# EasyEDA Pro project BackupProjects_martinnohr_personal_0_20240117.eprj

# Schematic Magic Image Wand PCB with PS

## Sheets
1 TTGO_CIRCUIT_PCB_PS
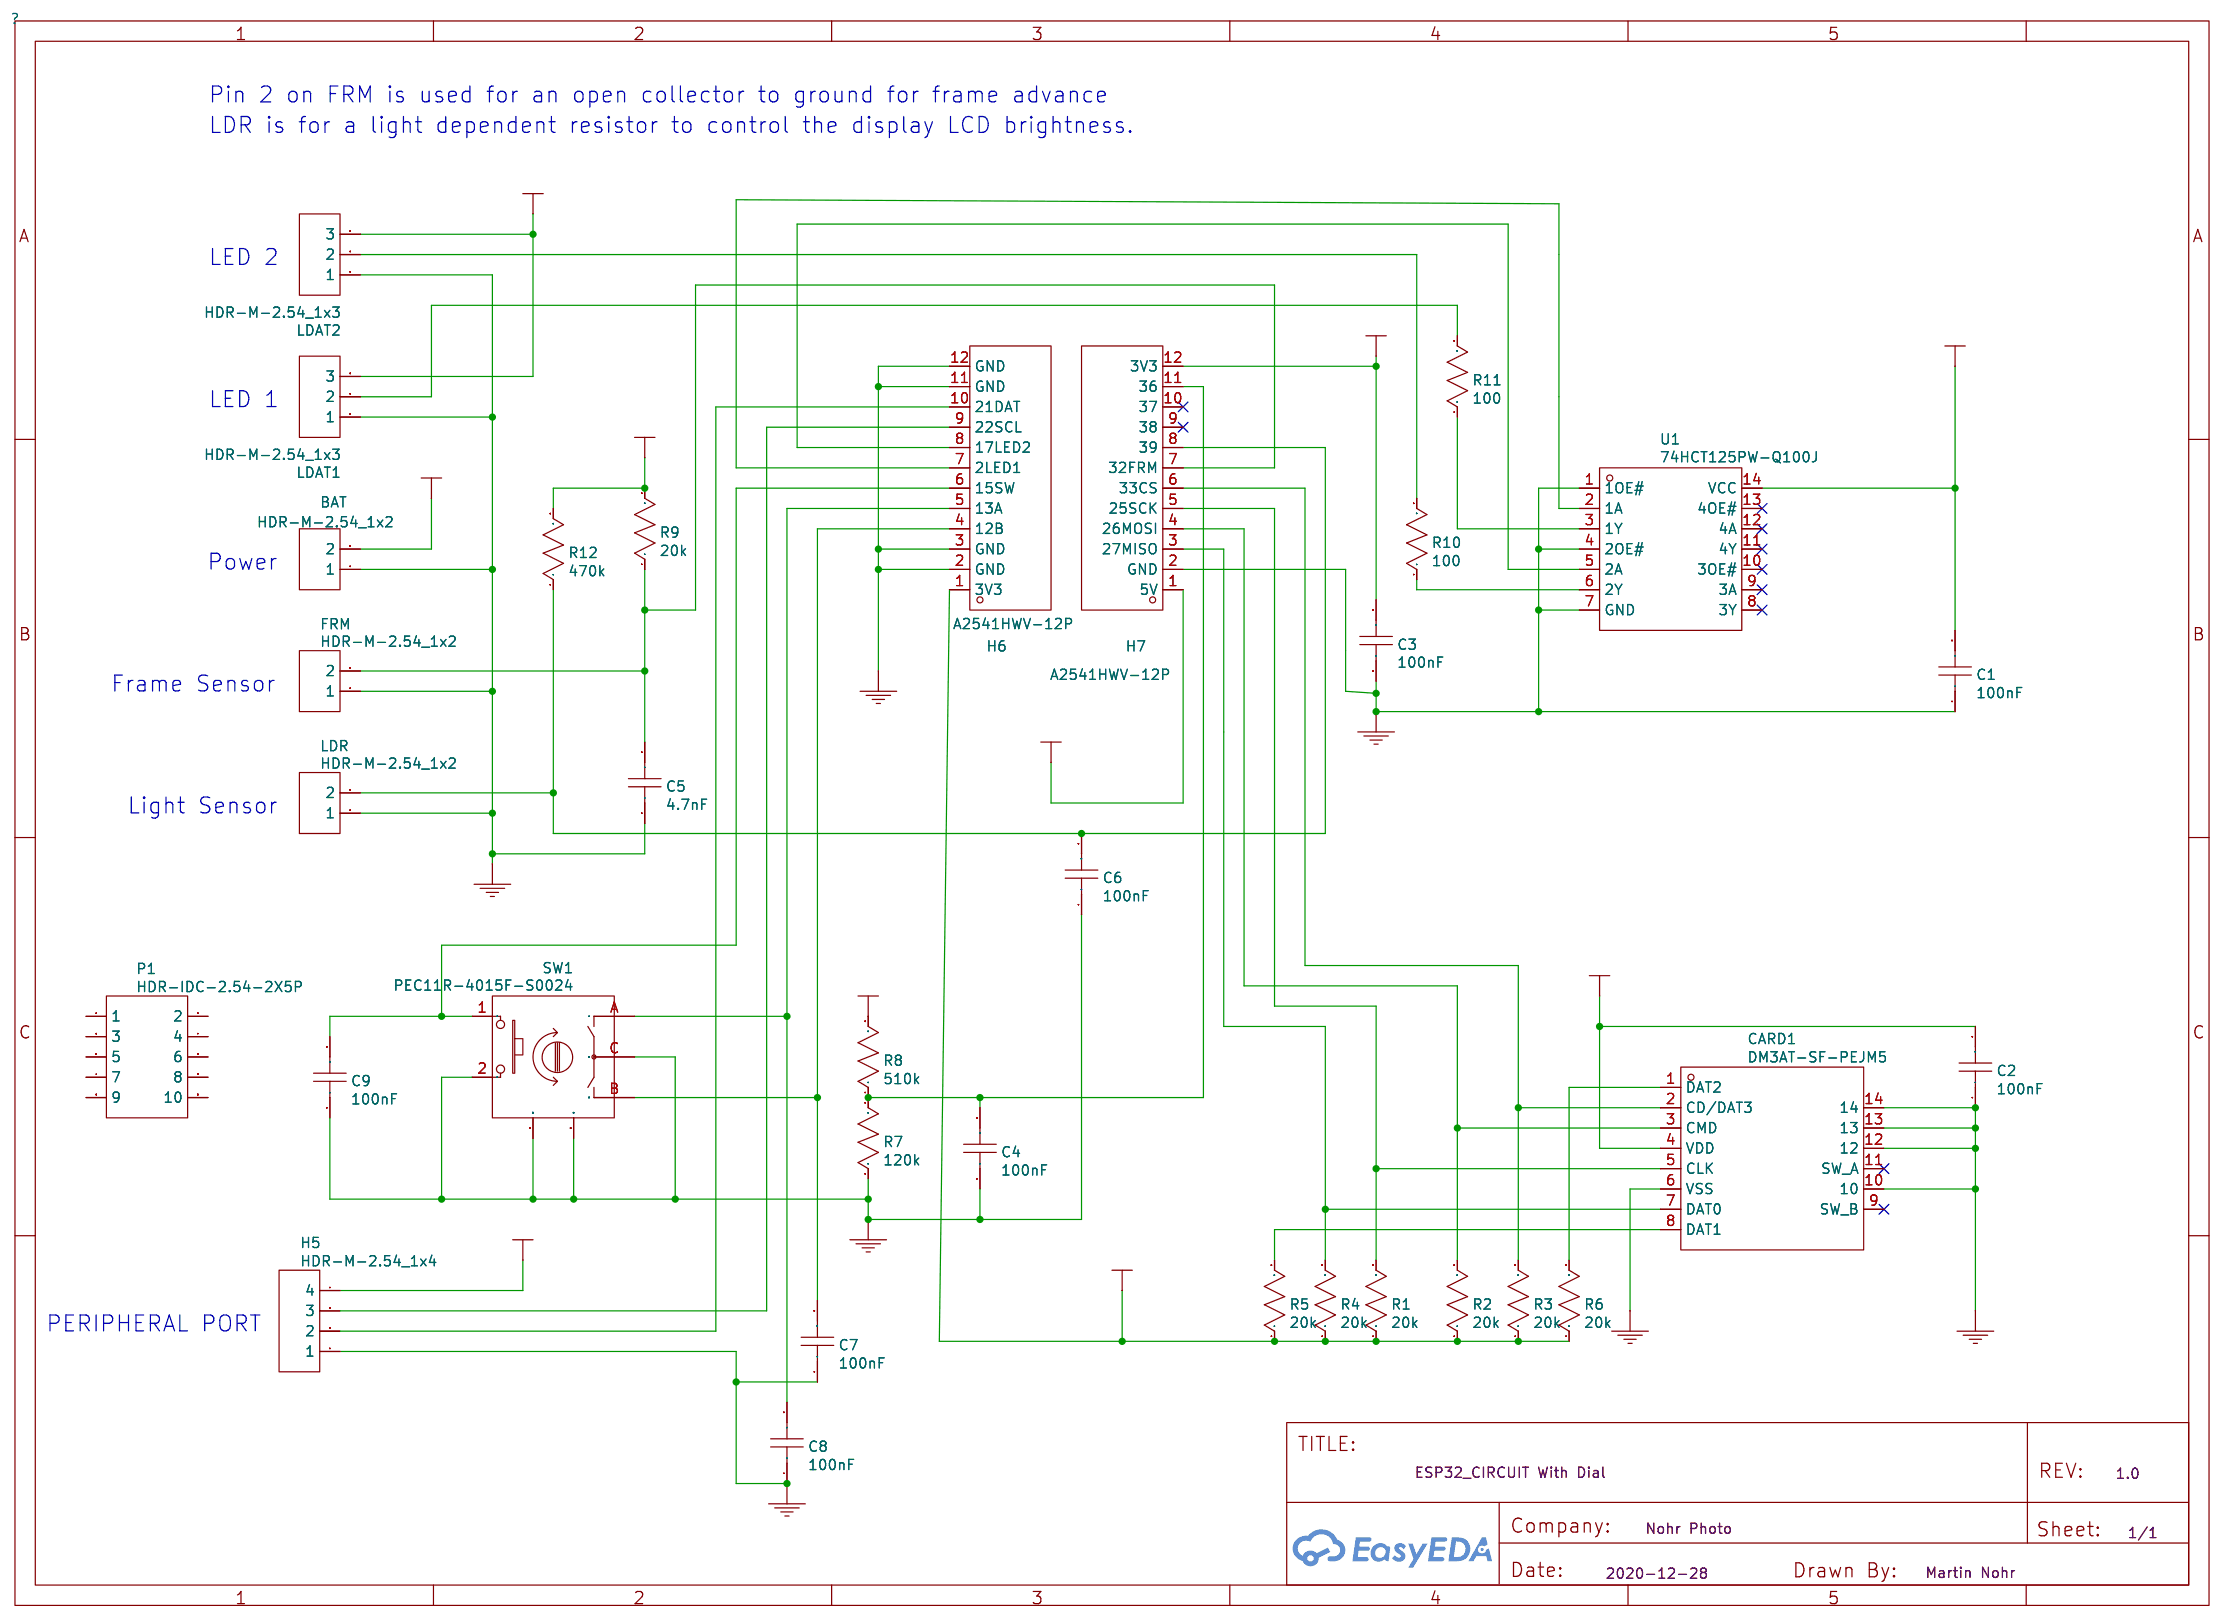
[diagram p0: TTGO_CIRCUIT_PCB_PS]
2 TTGO External Components
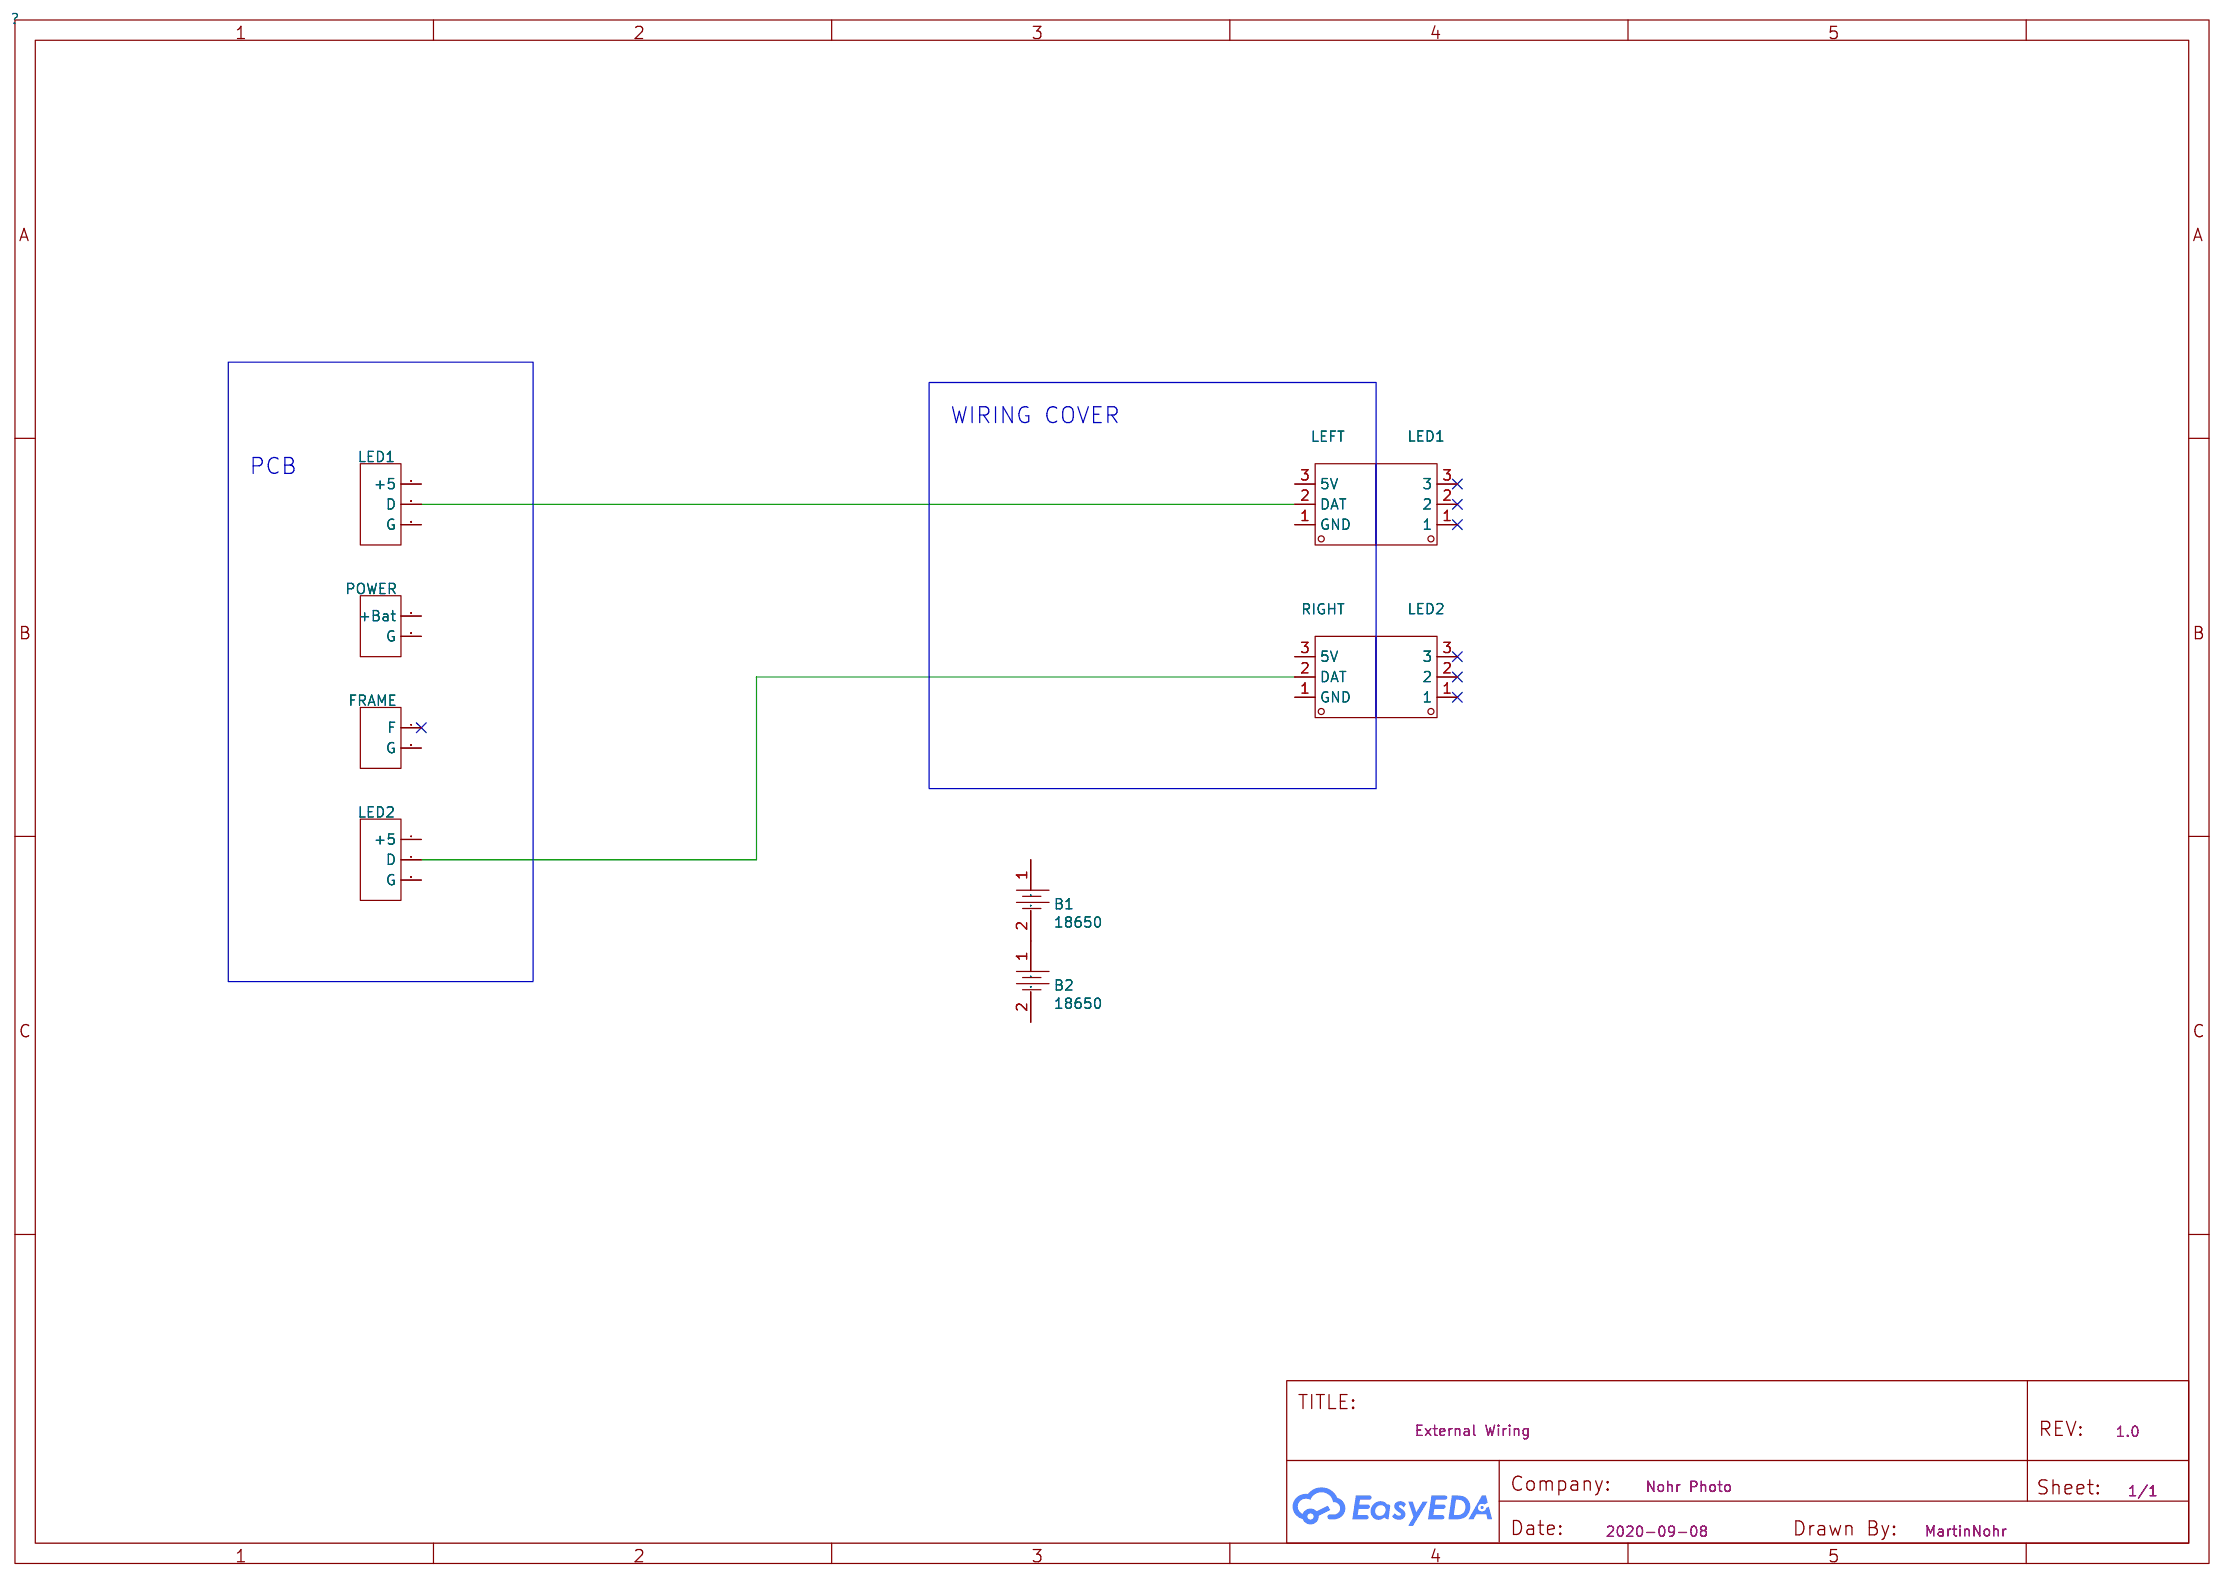
[diagram p1: TTGO External Components]
3 Power Supply
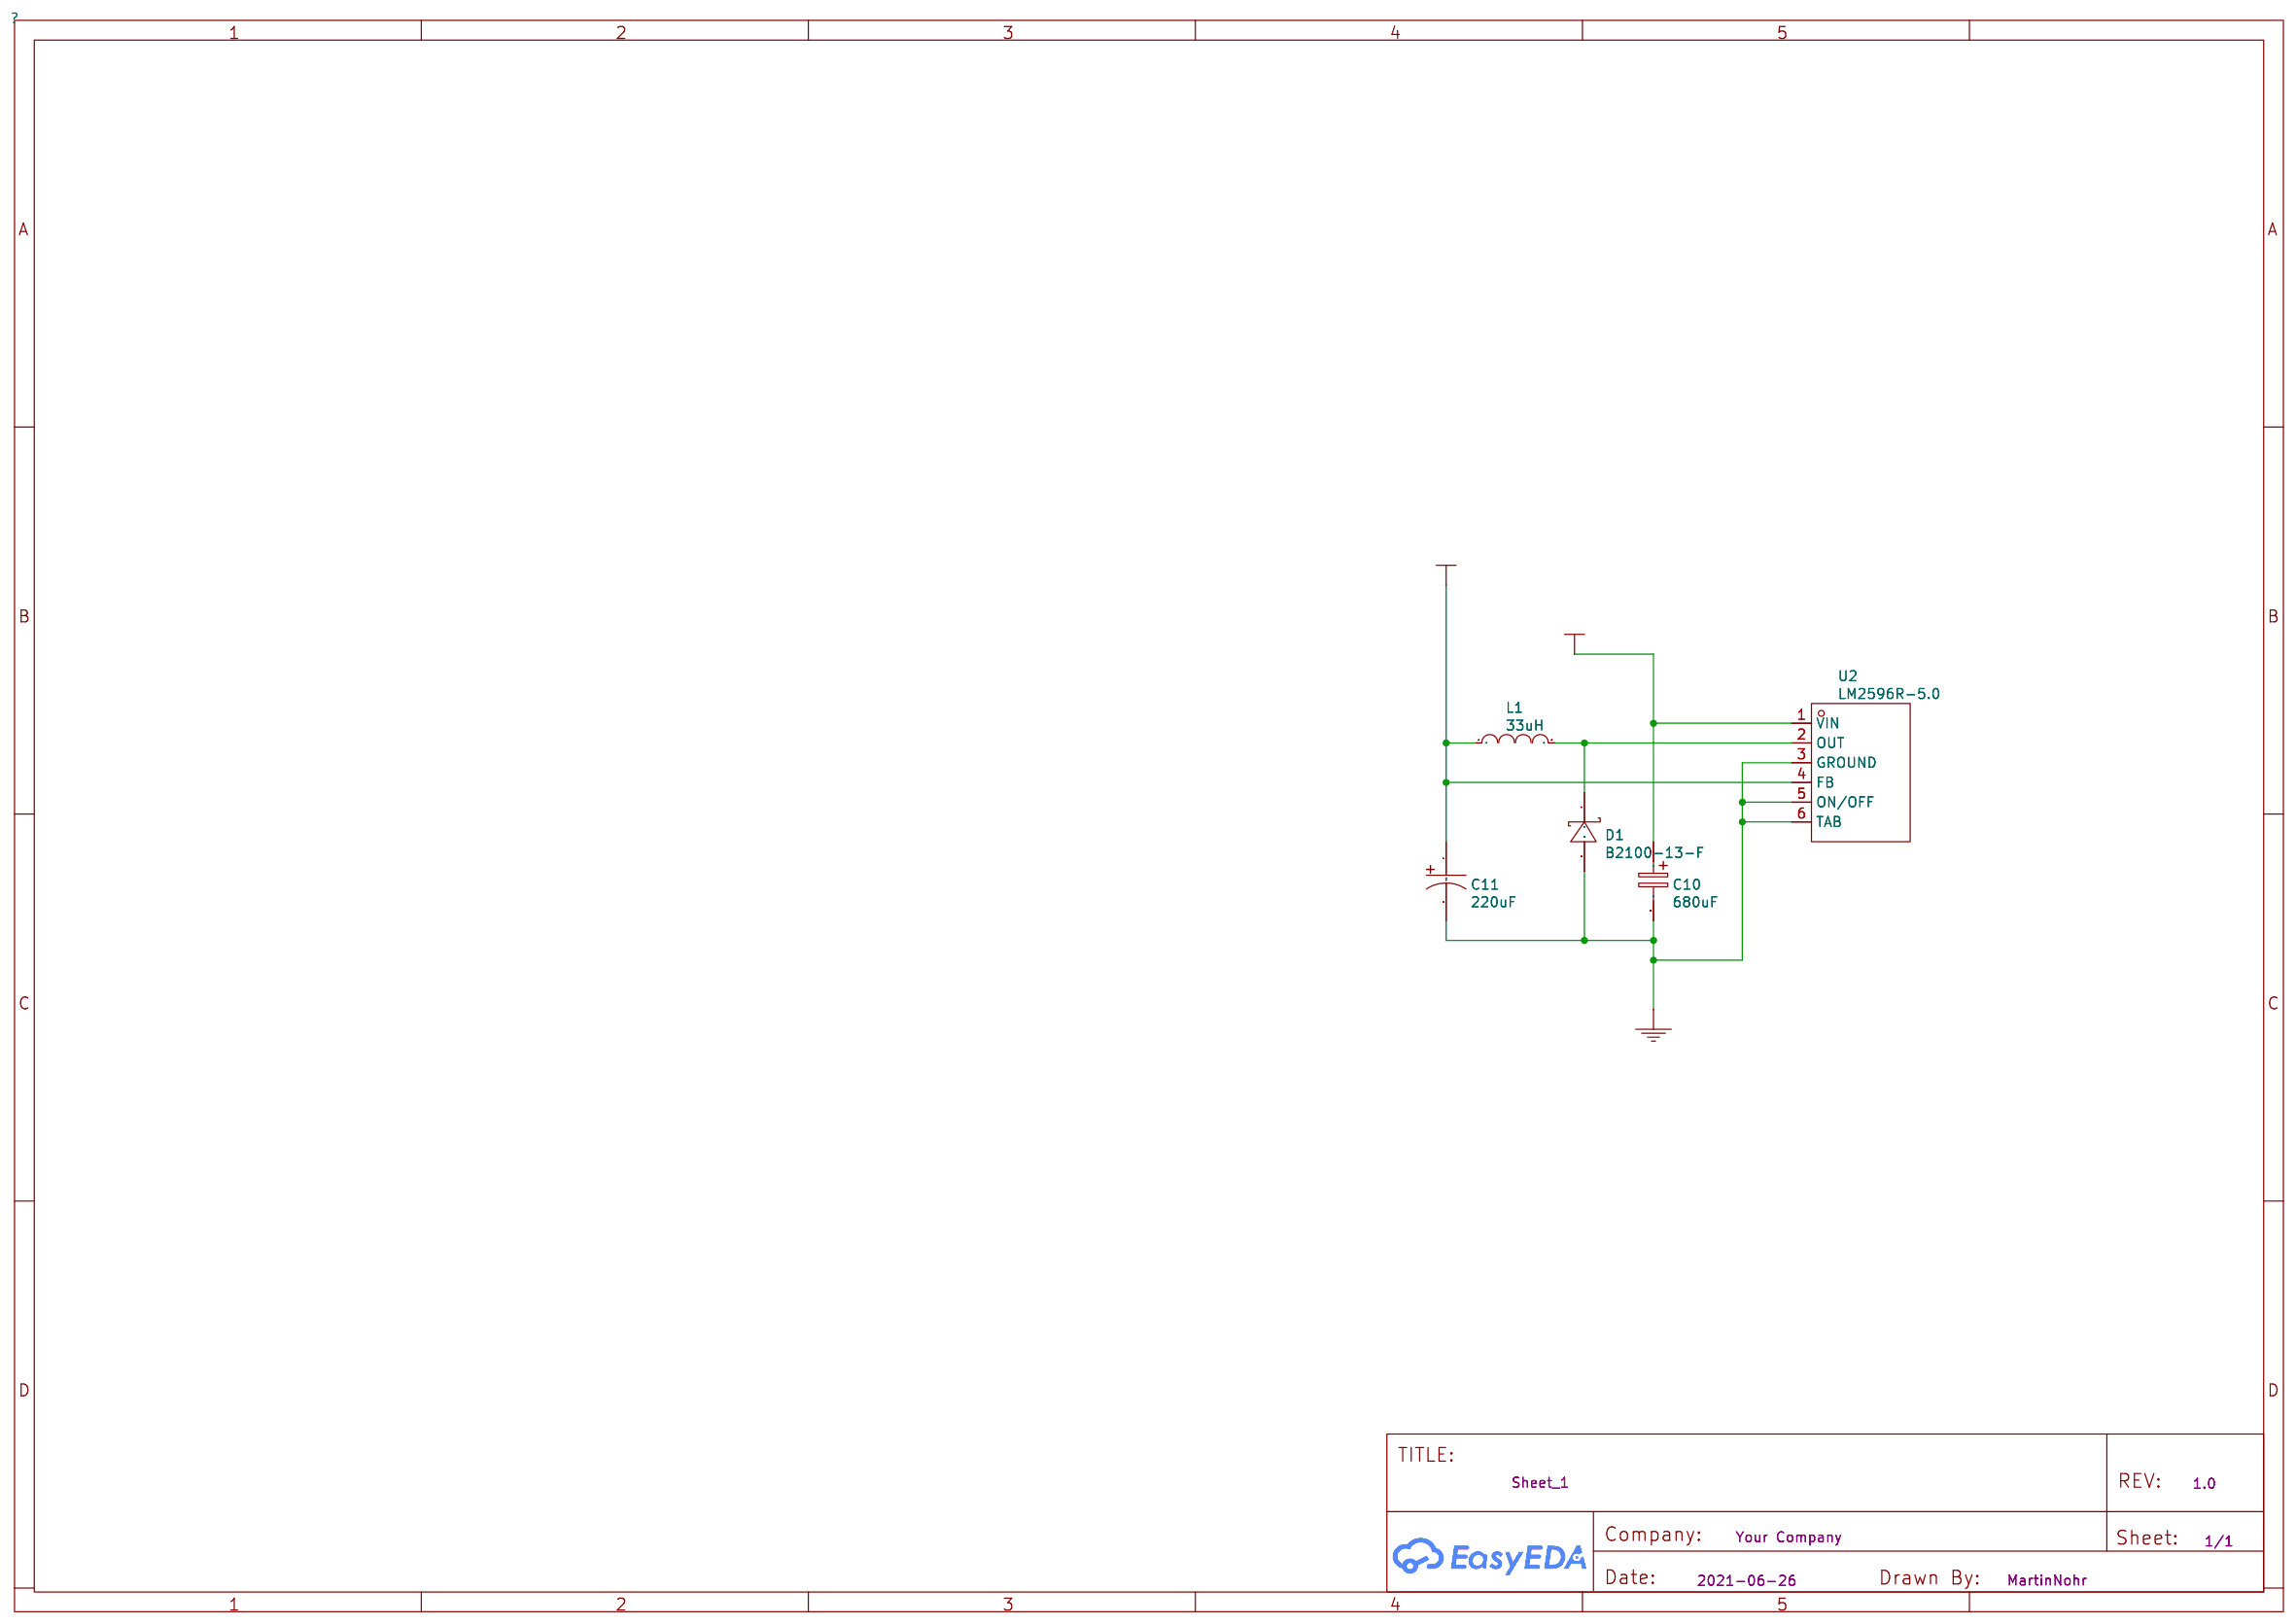
[diagram p2: Power Supply]

## Parts
sheet Power Supply
C10  680uF  [CAP-SMD_L7.3-W4.3-R-RD]
C11  220uF  [CAP-SMD_L7.3-W4.3]
D1  B2100-13-F  [SMB_L4.6-W3.6-LS5.3-RD]
L1  33uH  [IND-SMD_L12.5-W12.5_SWRH1207B]
U2  LM2596R-5.0  [TO-263-5_L10.2-W8.6-P1.70-LS14.4-TL]
sheet TTGO External Components
B1  18650  (no BOM)
B2  18650  (no BOM)
H8  LED1  (no BOM)
H9  LED2  (no BOM)
H10  POWER  (no BOM)
H11  FRAME  (no BOM)
LED1  68000-103HLF  (no BOM)
LED2  68000-103HLF  (no BOM)
LEFT  68000-103HLF  (no BOM)
RIGHT  68000-103HLF  (no BOM)
sheet TTGO_CIRCUIT_PCB_PS
BAT  HDR-M-2.54_1x2  [HDR-M-2.54_1X2]  (no BOM)
C1  100nF  [C0603]
C2  100nF  [C0603]
C3  100nF  [C0603]
C4  100nF  [C0603]
C5  4.7nF  [C0603]
C6  100nF  [C0603]
C7  100nF  [C0603]
C8  100nF  [C0603]
C9  100nF  [C0603]
CARD1  DM3AT-SF-PEJM5  [SD-SMD_DM3AT-SF-PEJM5]
FRM  HDR-M-2.54_1x2  [HDR-M-2.54_1X2]  (no BOM)
H5  HDR-M-2.54_1x4  [HDR-M-2.54_1X4]  (no BOM)
H6  A2541HWV-12P  [HDR-TH_12P-P2.54-V_A2541HWV-12P]
H7  A2541HWV-12P  [HDR-TH_12P-P2.54-V_A2541HWV-12P]
LDAT1  HDR-M-2.54_1x3  [HDR-M-2.54_1X3]  (no BOM)
LDAT2  HDR-M-2.54_1x3  [HDR-M-2.54_1X3]  (no BOM)
LDR  HDR-M-2.54_1x2  [HDR-M-2.54_1X2]  (no BOM)
P1  HDR-IDC-2.54-2X5P
R1  20k  [R0603]
R2  20k  [R0603]
R3  20k  [R0603]
R4  20k  [R0603]
R5  20k  [R0603]
R6  20k  [R0603]
R7  120k  [R0603]
R8  510k  [R0603]
R9  20k  [R0603]
R10  100  [R0603]
R11  100  [R0603]
R12  470k  [R0603]
SW1  PEC11R-4015F-S0024  [SW-TH_PEC11R-4XXXF-SXXXX]
U1  74HCT125PW-Q100J  [TSSOP-14_L5.0-W4.4-P0.65-LS6.4-BL]

## Library data of the parts
C10 = 680uF: link: https://item.szlcsc.com/91116.html; 3DModel: CASE-E_L7.3-W4.3-H4.1; Supplier: LCSC; Supplier Part: C542619; Manufacturer: PANASONIC; Manufacturer Part: ETPF680M5H
C11 = 220uF: link: https://item.szlcsc.com/292603.html; 3DModel: CASE-E_L7.3-W4.3-H4.1; Supplier: LCSC; Supplier Part: C215882; Manufacturer: Vishay Intertech; Manufacturer Part: 293D227X9016E2TE3; JLCPCB Part Class: Extended Part
D1 = B2100-13-F: link: https://item.szlcsc.com/288502.html; Supplier: LCSC; Manufacturer: DIODES; Supplier Part: C110479; JLCPCB Part Class: Extended Part
L1 = 33uH: link: https://item.szlcsc.com/61711.html; 3DModel: IND-SMD_L12.5-W12.5-H8.0; Supplier: LCSC; Manufacturer: Sunlord; Manufacturer Part: SWRH1207B-330MT; Supplier Part: C127811; JLCPCB Part Class: Extended Part
U2 = LM2596R-5.0: link: https://item.szlcsc.com/139878.html; 3DModel: TO-263-5-5P_L10.2-W8.7-H4.5-LS14.4-P1.70; Supplier: LCSC; Manufacturer: HTC; Supplier Part: C77782; JLCPCB Part Class: Extended Part
B1 B2 = CR1220-2: Supplier: LCSC; Manufacturer: Q&J; image: //image.lceda.cn/szlcsc/C70381.jpg; Supplier Part: C70381
H8 = LED1: Supplier Part: C146690; Supplier: LCSC
H9 = LED2: Supplier Part: C146690; Supplier: LCSC
H10 = POWER: Supplier Part: C49661; Supplier: LCSC
H11 = FRAME: Supplier Part: C49661; Supplier: LCSC
LED1 LED2 LEFT RIGHT = 68000-103HLF: Supplier: LCSC; Supplier Part: C168677; Manufacturer: Amphenol ICC
BAT FRM LDR = HDR-M-2.54_1x2: Supplier Part: C124375; Supplier: LCSC
C1-C4 C6-C9 = 100nF: link: https://item.szlcsc.com/362304.html; 3DModel: C0603_L1.6-W0.8-H0.8; Supplier: LCSC; Supplier Part: C15725; Manufacturer: SAMSUNG; Manufacturer Part: CL10B104KC8NNNC
C5 = 4.7nF: Supplier: LCSC; Supplier Part: C106218; Manufacturer: YAGEO; Manufacturer Part: CC0603KRX7R9BB472
CARD1 = DM3AT-SF-PEJM5: Supplier: LCSC; Supplier Part: C114218; Manufacturer: Hirose; link: https://item.szlcsc.com/115458.html
H5 = HDR-M-2.54_1x4: Supplier Part: C124378; Supplier: LCSC
H6 H7 = A2541HWV-12P: Supplier: LCSC; Supplier Part: C225509; Manufacturer: Changjiang Connectors; JLCPCB Part Class: Extend
LDAT1 LDAT2 = HDR-M-2.54_1x3: Supplier Part: C180248; Supplier: LCSC
P1 = IDC Box 2.54mm 2X5P: Supplier: LCSC; Manufacturer: BOOMELE; image: //image.lceda.cn/szlcsc/C5665.jpg; Supplier Part: C5665
R1-R6 R9 = 20k: Supplier Part: C4184; Supplier: LCSC; Manufacturer Part: 0603WAF2002T5E; Manufacturer: UniOhm
R7 = 120k: link: https://item.szlcsc.com/137208.html; 3DModel: R0603_L1.6-W0.8-H0.8; Supplier Part: C25808; Supplier: LCSC; Manufacturer Part: 0603WAF1203T5E; Manufacturer: UniOhm
R8 = 510k: link: https://item.szlcsc.com/137208.html; 3DModel: R0603_L1.6-W0.8-H0.8; Supplier Part: C23192; Supplier: LCSC; Manufacturer Part: 0603WAF5103T5E; Manufacturer: UniOhm
R10 R11 = 100: link: https://item.szlcsc.com/137208.html; 3DModel: R0603_L1.6-W0.8-H0.8; Supplier Part: C22775; Supplier: LCSC; Manufacturer Part: 0603WAF1000T5E; Manufacturer: UniOhm
R12 = 470k: link: https://item.szlcsc.com/137208.html; 3DModel: R0603_L1.6-W0.8-H0.8; Supplier Part: C23178; Supplier: LCSC; Manufacturer Part: 0603WAF4703T5E; Manufacturer: UniOhm
SW1 = PEC11R-4015F-S0024: Supplier: LCSC; Supplier Part: C143817; Manufacturer: BOURNS; 3DModel: pec11r-4015f-s0024
U1 = 74HCT125PW-Q100J: link: https://item.szlcsc.com/8137.html; 3DModel: TSSOP-14_L5.0-W4.4-H1.0-LS6.4-P0.65; Supplier: LCSC; Supplier Part: C545658; Manufacturer: Nexperia; JLCPCB Part Class: Extended Part

## Nets
+5V: C1.2 C11.1 H7.1(5V) L1.1 LDAT1.3 LDAT2.3 U1.14(VCC) U2.4(FB)
GND: BAT.1 C1.1 C2.1 C3.1 C4.1 C5.1 C6.1 C7.1 C8.1 C9.1 C10.2 C11.2 CARD1.6(VSS) CARD1.10 CARD1.12 CARD1.13 CARD1.14 D1.2 FRM.1 H5.1 H6.2(GND) H6.3(GND) H6.11(GND) H6.12(GND) H7.2(GND) LDAT1.1 LDAT2.1 LDR.1 R7.1 SW1.2 SW1.C SW1.MT1 SW1.MT2 U1.1(1OE#) U1.4(2OE#) U1.7(GND) U2.3(GROUND) U2.5(ON/OFF) U2.6(TAB)
VCC: C2.2 C3.2 CARD1.4(VDD) H5.4 H6.1(3V3) H7.12(3V3) R1.1 R2.1 R3.1 R4.1 R5.1 R6.1 R9.2 R12.2
BATTERY: BAT.2 C10.1 R8.2 U2.1(VIN)
C5_2: C5.2 FRM.2 H7.7(32FRM) R9.1
CARD1_1: CARD1.1(DAT2) R6.2
CARD1_2: CARD1.2(CD/DAT3) H7.6(33CS) R3.2
CARD1_3: CARD1.3(CMD) H7.4(26MOSI) R2.2
CARD1_5: CARD1.5(CLK) H7.5(25SCK) R1.2
CARD1_7: CARD1.7(DAT0) H7.3(27MISO) R4.2
CARD1_8: CARD1.8(DAT1) R5.2
H5_2: H5.2 H6.10(21DAT)
H5_3: H5.3 H6.9(22SCL)
H6_7: H6.7(2LED1) U1.2(1A)
H6_8: H6.8(17LED2) U1.5(2A)
H7_8: C6.2 H7.8(39) LDR.2 R12.1
H7_11: C4.2 H7.11(36) R7.2 R8.1
LDAT1_2: LDAT1.2 R11.2
Net-(B1-2): B1.2 B2.1
Net-(H8-2): H8.2(D) LEFT.2(DAT)
Net-(H9-2): H9.2(D) RIGHT.2(DAT)
Net-(LDAT2-2): LDAT2.2 R10.2
SW1_1: C9.2 H6.6(15SW) SW1.1
SW1_A: C8.2 H6.5(13A) SW1.A
SW1_B: C7.2 H6.4(12B) SW1.B
U1_3: R11.1 U1.3(1Y)
U1_6: R10.1 U1.6(2Y)
U2_2: D1.1 L1.2 U2.2(OUT)

Not connected (* = marked no-connect by the designer): B1 1; B2 2; CARD1 9(SW_B)* 11(SW_A)*; H7 9(38)* 10(37)*; H8 1(+5) 3(G); H9 1(+5) 3(G); H10 1(+Bat) 2(G); H11 1(F)* 2(G); LED1 1* 2* 3*; LED2 1* 2* 3*; LEFT 1(GND) 3(5V); P1 1 2 3 4 5 6 7 8 9 10; RIGHT 1(GND) 3(5V); U1 8(3Y)* 9(3A)* 10(3OE#)* 11(4Y)* 12(4A)* 13(4OE#)*

## Notes on the sheets
sheet 1
- Pin 2 on FRM is used for an open collector to ground for frame advance
- LDR is for a light dependent resistor to control the display LCD brightness.
- LED 2
- LED 1
- Power
- Frame Sensor
- Light Sensor
- PERIPHERAL PORT
sheet 2
- WIRING COVER
- PCB

# Board 1-PCB_TTGO MIW PCB PS
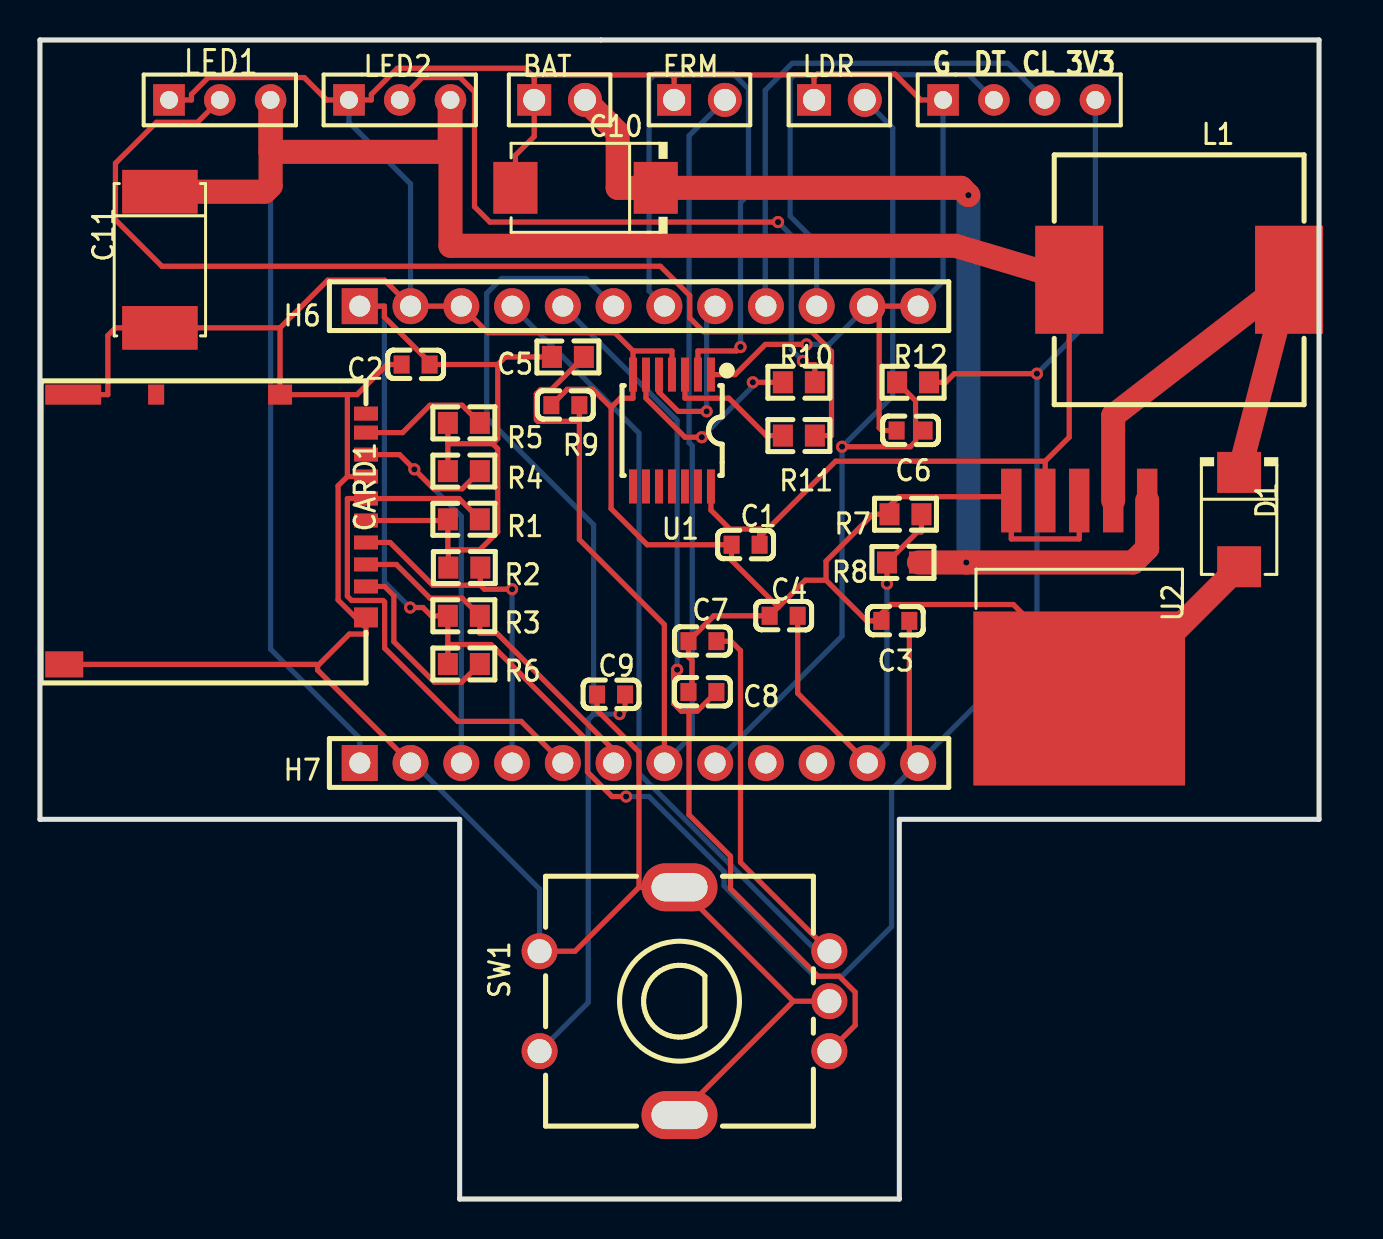
[diagram p3: board, top side]
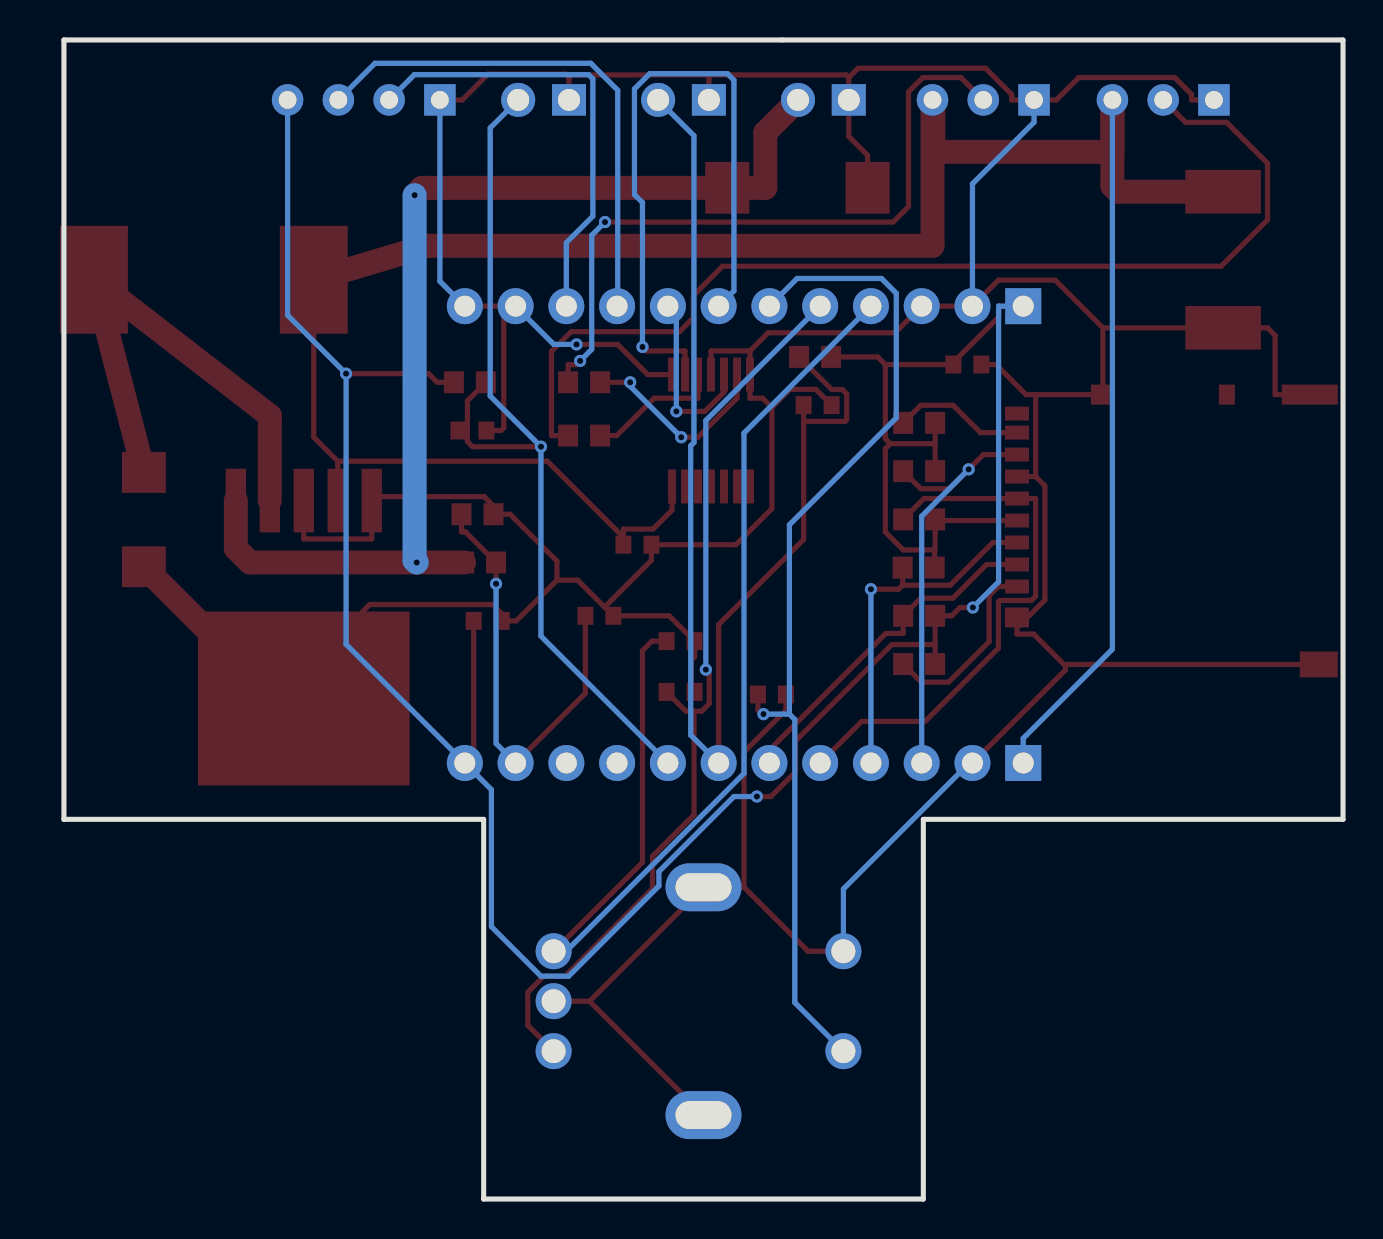
[diagram p4: board, bottom side, seen from below]

Outline 64 x 58 mm; copper layers: Top Layer, Bottom Layer. Coordinates in mm from the lower left corner of the outline.
Outline path: 0,58 64,58 64,19 43,19 43,0 21,0 21,19 0,19 0,58
Stack: Top Layer 0.035mm / Dielectric1 1.51mm FR4 er 4.5 / Bottom Layer 0.035mm

## Design rules (mm)
spacing Default (default): track to track 0.152, other pairs 0 to 0.152
track width Default (default): min 0.254, default 0.254, max 25.4
differential pair differentialPair (default): width min 0.127, default 0.254, max 2.54; gap min 0.152, default 0.152
via Default (default): diameter min 0.61, default 0.61, max 100.025; hole min 0.305, default 0.305, max 59.995
net +5V uses gge45507
pour e1 uses gge44996
pour e2 uses gge45507

## Placement (name value [footprint] x y rotation side)
BAT  HDR-M-2.54_1x2  [HDR-M-2.54_1X2]  26 55 0 top
C1  100nF  [C0603]  35.31 32.74 0 top
C2  100nF  [C0603]  18.8 41.76 0 top
C3  100nF  [C0603]  42.8 28.93 0 top
C4  100nF  [C0603]  37.21 29.18 0 top
C5  4.7nF  [C0603]  26.29 39.73 0 top
C6  100nF  [C0603]  43.56 38.46 0 top
C7  100nF  [C0603]  33.15 27.91 0 top
C8  100nF  [C0603]  33.15 25.37 0 top
C9  100nF  [C0603]  28.57 25.25 0 top
C10  680uF  [CAP-SMD_L7.3-W4.3-R-RD]  27.3 50.6 0 top
C11  220uF  [CAP-SMD_L7.3-W4.3]  6 47 90 top
CARD1  DM3AT-SF-PEJM5  [SD-SMD_DM3AT-SF-PEJM5]  8.76 33.5 270 top
D1  B2100-13-F  [SMB_L4.6-W3.6-LS5.3-RD]  60 34 270 top
FRM  HDR-M-2.54_1x2  [HDR-M-2.54_1X2]  33 55 0 top
H5  HDR-M-2.54_1x4  [HDR-M-2.54_1X4]  49 55 0 top
H6  A2541HWV-12P  [HDR-TH_12P-P2.54-V_A2541HWV-12P]  29.97 44.68 0 top
H7  A2541HWV-12P  [HDR-TH_12P-P2.54-V_A2541HWV-12P]  29.97 21.82 0 top
L1  33uH  [IND-SMD_L12.5-W12.5_SWRH1207B]  57 46 0 top
LDAT1  HDR-M-2.54_1x3  [HDR-M-2.54_1X3]  9 55 0 top
LDR  HDR-M-2.54_1x2  [HDR-M-2.54_1X2]  40 55 0 top
LED2  68000-103HLF  [HDR-M-2.54_1X3]  18 55 0 top
R1  20k  [R0603]  21.21 34.01 0 top
R2  20k  [R0603]  21.23 31.6 0 top
R3  20k  [R0603]  21.21 29.18 0 top
R4  20k  [R0603]  21.21 36.42 0 top
R5  20k  [R0603]  21.21 38.84 0 top
R6  20k  [R0603]  21.21 26.77 0 top
R7  120k  [R0603]  43.31 34.26 0 top
R8  510k  [R0603]  43.18 31.85 0 top
R9  20k  [R0603]  26.42 42.14 180 top
R10  100  [R0603]  37.97 40.87 0 top
R11  100  [R0603]  37.97 38.2 0 top
R12  470k  [R0603]  43.69 40.87 0 top
SW1  PEC11R-4015F-S0024  [SW-TH_PEC11R-4XXXF-SXXXX]  32.25 9.9 90 top
U1  74HCT125PW-Q100J  [TSSOP-14_L5.0-W4.4-P0.65-LS6.4-BL]  31.62 38.46 180 top
U2  LM2596R-5.0  [TO-263-5_L10.2-W8.6-P1.70-LS14.4-TL]  52 30 270 top

## Footprints (pads in the part's own frame, mm; a bottom-side part is the same pattern mirrored in y, then rotated)
C0603
  rect 0.8x0.9 smd: 1(-0.7,0) 2(0.7,0)
CAP-SMD_L7.3-W4.3
  rect 2.185x3.78 smd: 1(3.406,0) 2(-3.406,0)
CAP-SMD_L7.3-W4.3-R-RD
  rect 2.208x2.592 smd: 1(3.511,0) 2(-3.511,0)
HDR-M-2.54_1X2
  rect 1.7x1.575 hole 1.1: 1(-1.27,0)
  round 1.7 hole 1.1: 2(1.27,0)
HDR-M-2.54_1X3
  rect 1.575x1.575 hole 0.889: 1(-2.54,0)
  round 1.575 hole 0.889: 2(0,0) 3(2.54,0)
HDR-M-2.54_1X4
  rect 1.575x1.575 hole 0.889: 1(-3.81,0)
  round 1.575 hole 0.889: 2(-1.27,0) 3(1.27,0) 4(3.81,0)
HDR-TH_12P-P2.54-V_A2541HWV-12P
  rect 1.8x1.8 hole 1.05: 1(-13.97,0)
  round 1.8 hole 1.05: 2(-11.43,0) 3(-8.89,0) 4(-6.35,0) 5(-3.81,0) 6(-1.27,0) 7(1.27,0) 8(3.81,0) 9(6.35,0) 10(8.89,0) 11(11.43,0) 12(13.97,0)
IND-SMD_L12.5-W12.5_SWRH1207B
  rect 3.4x5.4 smd: 1(-5.5,0) 2(5.5,0)
R0603
  rect 1x1.1 smd: 1(-0.8,0) 2(0.8,0)
SD-SMD_DM3AT-SF-PEJM5
  rect 0.7x1.2 smd: 1(2.85,7.55) 2(1.75,7.55) 3(0.65,7.55) 4(-0.45,7.55) 5(-1.55,7.55) 6(-2.65,7.55) 7(-3.75,7.55) 8(-4.85,7.55) 9(-5.8,7.55)
  rect 1x1.2 smd: 10(-6.75,3.25) 14(4.4,7.55)
  rect 1x0.8 smd: 11(-6.75,-2.95)
  rect 1x2.8 smd: 12(-6.75,-7.1)
  rect 1.3x1.9 smd: 13(6.75,-7.55)
SMB_L4.6-W3.6-LS5.3-RD
  rect 2.047x2.192 smd: 1(-2.361,0) 2(2.361,0)
SW-TH_PEC11R-4XXXF-SXXXX
  round 1.8 hole 1.2: 1(-2.5,7.25) 2(2.5,7.25) A(-2.5,-7.25) B(2.5,-7.25) C(0,-7.25)
  oval 2.4x3.8 hole 1.4x2.8: MT1(-5.7,0.249) MT2(5.7,0.249)
TO-263-5_L10.2-W8.6-P1.70-LS14.4-TL
  rect 3.183x1.02 smd: 1(-4.953,3.4) 2(-4.953,1.7) 3(-4.953,0) 4(-4.953,-1.7) 5(-4.953,-3.4)
  rect 8.705x10.587 smd: 6(4.953,0)
TSSOP-14_L5.0-W4.4-P0.65-LS6.4-BL
  rect 0.4x1.7 smd: 1(-1.95,-2.8) 2(-1.3,-2.8) 3(-0.65,-2.8) 4(0,-2.8) 5(0.65,-2.8) 6(1.3,-2.8) 7(1.95,-2.8) 8(1.95,2.8) 9(1.3,2.8) 10(0.65,2.8) 11(0,2.8) 12(-0.65,2.8) 13(-1.3,2.8) 14(-1.95,2.8)

## Nets
As in the schematic, except:
+5V: C1.2 C11.1 H7.1 L1.1 LDAT1.3 LED2.3 U1.14 U2.4
GND: BAT.1 C1.1 C2.1 C3.1 C4.1 C5.1 C6.1 C7.1 C8.1 C9.1 C10.2 C11.2 CARD1.6 CARD1.10 CARD1.12 CARD1.13 CARD1.14 D1.2 FRM.1 H5.1 H6.2 H6.3 H6.11 H6.12 H7.2 LDAT1.1 LDR.1 LED2.1 R7.1 SW1.2 SW1.C SW1.MT1 SW1.MT2 U1.1 U1.4 U1.7 U2.3 U2.5 U2.6
LDAT2_2: LED2.2 R10.2

Pads without a net: CARD1 9 11; H7 9 10; U1 8 9 10 11 12 13

## Via types
v1: diameter 0.61, hole 0.31, Top Layer to Bottom Layer, 18 vias

## Routing (per net, layer and track width the routed paths; a pad name or vN(x,y) marks a point on that pad's centre or on a via; arc(x,y) is an arc through that point)
+5V: length 192.5
  Top Layer w0.26: 50.3,36.92 51.5,38.12 L1.1 45.8,47.7 20.54,47.7 LED2.3 20.5,54.96 20.5,52.4 11.54,52.4 ; 50.3,36.92 39.81,36.92 36.01,33.11 ; 50.3,36.92 50.3,34.95 ; 11.54,52.4 11.54,50.7 11.24,50.41 C11.1 ; 11.54,52.4 LDAT1.3 11.54,52.4 ; 36.01,33.11 36.01,32.74 ; 36.01,33.11 36.01,33.52 34.52,33.52 33.57,34.47 33.57,35.65
  Top Layer w1.2: L1.1 45.8,47.7 20.54,47.7 LED2.3 20.5,54.96 20.5,52.4 11.54,52.4 LDAT1.3 11.54,50.7 11.25,50.41 C11.1
  Bottom Layer w0.26: LDAT1.3 11.54,27.51 16,23.05 H7.1
GND: length 315.9
  Top Layer w0.26: CARD1.13 13.81,26.75 13.89,26.68 ; 16.31,28.69 16.31,28.27 15.48,28.27 13.89,26.68 ; 16.31,28.69 CARD1.14 ; 16.31,28.69 16.21,28.69 14.92,29.97 14.92,35.69 15.38,36.15 ; C5.1 26.38,40.52 27.67,40.52 28.58,39.61 ; 13.89,26.68 13.89,26.47 H7.2 ; 29.97,15.6 29.97,22.37 27.87,24.47 27.87,25.25 ; 29.97,15.6 26.77,12.4 25,12.4 ; 29.97,15.6 32,15.6 37.7,9.9 ; 15.38,40.25 12.01,40.25 12.01,43.59 ; 15.38,40.25 15.38,36.15 ; 15.38,40.25 15.86,40.25 17.36,41.76 C2.1 ; 53.41,25.05 48.7,29.75 42.55,29.75 41.73,28.93 ; 53.41,25.05 60,31.64 ; 53.41,25.05 52,25.05 ; 12.01,43.59 14.4,45.98 17.24,45.98 H6.2 H6.3 22.41,43.35 28.76,43.35 29.67,42.44 ; 12.01,43.59 C11.2 3.78,43.59 3.4,43.21 3.4,40.25 CARD1.12 ; 42.86,38.46 42.13,38.46 41.99,38.59 41.99,44.68 ; 28.58,39.61 29.04,40.07 29.67,40.07 U1.7 29.67,42.44 ; 28.58,39.61 28.58,34.54 30.38,32.74 34.6,32.74 34.6,31.96 36.95,29.62 ; 45.19,55 44.07,55 42.78,56.29 38.91,56.29 38.73,56.12 ; 31.73,56.12 31.86,56.25 38.6,56.25 38.73,56.12 ; 31.73,56.12 31.6,56.25 24.86,56.25 24.73,56.12 ; 31.73,56.12 FRM.1 ; 36.95,29.62 36.51,29.18 33.72,29.18 32.45,27.91 32.45,27.13 32.62,26.96 32.62,25.55 32.45,25.37 ; 36.95,29.62 38.29,30.97 39.33,30.97 ; 24.73,56.12 BAT.1 24.73,53.17 23.79,52.23 C10.2 ; 24.73,56.12 24.27,56.58 17.88,56.58 16.58,55.28 16.58,55 LED2.1 14.34,55 13.22,56.12 8.42,56.12 7.58,55.28 7.58,55 6.46,55 ; 41.99,44.68 H6.12 ; 41.99,44.68 H6.11 ; 42.09,34.26 41.68,34.26 39.33,31.92 39.33,30.97 ; 42.09,34.26 42.97,35.15 48.41,35.15 48.6,34.95 48.6,33.03 52,33.03 52,34.95 ; 42.09,34.26 42.51,34.26 ; v1(38.35,42.76) 36.29,42.76 34.79,41.25 33.57,41.25 ; 38.73,56.12 LDR.1 ; SW1.C 37.7,9.9 ; 37.7,9.9 SW1.MT1 ; 42.1,28.93 41.73,28.93 ; 41.73,28.93 41.37,28.93 39.33,30.97 ; U1.4 31.62,42.44 29.67,42.44 ; 15.38,36.15 CARD1.6
  Top Layer w1.2: D1.2 53.41,25.05 U2.6
  Bottom Layer w0.26: 25,12.4 25,15.51 18.69,21.82 H7.2 ; H6.2 18.54,50.8 15.46,53.88 LED2.1 ; H6.11 39.49,42.76 v1(38.35,42.76) ; H6.12 45.19,45.93 45.19,55
VCC: length 145.2
  Top Layer w0.26: 20.43,32.48 22,32.48 22.9,33.38 22.9,37.54 22.65,37.8 ; 20.43,32.48 R2.1 ; 20.43,32.48 20.41,32.5 20.41,33.95 ; v1(49.88,41.3) 45.75,41.3 45.32,40.87 R12.2 ; 19.61,41.76 17.23,44.13 17.23,44.68 H6.1 ; 19.61,41.76 22.9,41.76 ; 19.61,41.76 C2.2 ; H7.12 43.5,22.26 C3.2 ; 22.65,37.8 20.41,37.8 ; 22.65,37.8 22.9,38.05 22.9,41.76 ; 20.41,37.8 R5.1 ; 20.41,37.8 R4.1 ; 20.41,27.75 R6.1 ; 20.41,27.75 22.57,27.75 27.39,22.93 27.39,21.37 28.63,20.14 v1(29.33,20.14) ; 20.41,27.75 R3.1 19.58,29.18 19.16,29.6 v1(18.52,29.6) ; 22.9,41.76 23.28,42.14 R9.2 ; 20.41,33.95 R1.1 ; 20.41,33.95 CARD1.4
  Bottom Layer w0.26: v1(18.52,29.6) 17.23,30.88 17.23,44.68 H6.1 ; 52.81,55 52.81,44.23 v1(49.88,41.3) 49.88,27.76 H7.12 42.61,20.49 42.61,13.63 40.13,11.15 38.75,11.15 34.23,15.67 34.23,16.38 30.47,20.14 v1(29.33,20.14)
BATTERY: length 55.3
  Top Layer w1.2: v1(46.45,50.23) 46.09,50.6 C10.1 28.91,50.6 28.91,53.36 BAT.2 ; R8.2 v1(46.35,31.85) 54.69,31.85 55.4,32.56 55.4,34.95
  Bottom Layer w1.2: v1(46.35,31.85) 46.45,31.96 v1(46.45,50.23)
C5_2: length 60.9
  Top Layer w0.26: 26.99,38.92 24.91,38.92 24.84,38.99 24.84,40.29 25.05,40.51 25.59,40.51 R9.1 ; 26.99,38.92 26.99,33 31.24,28.75 H7.7 ; 26.99,38.92 26.99,39.73
  Bottom Layer w0.26: FRM.2 32.48,53.21 32.48,37.86 32.64,37.69 32.64,23.22 H7.7
CARD1_1: length 9.4
  Top Layer w0.26: CARD1.1 17.24,30.65 17.71,30.19 17.71,27.89 19.73,25.86 21.1,25.86 R6.2
CARD1_2: length 17.4
  Top Layer w0.26: H7.6 28.7,22.47 22.87,28.3 22.01,28.3 R3.2 21.13,30.07 19.52,30.07 17.83,31.75 CARD1.2
CARD1_3: length 17.9
  Top Layer w0.26: 22.03,30.72 22.24,30.52 v1(23.62,30.52) ; 22.03,30.72 19.65,30.72 17.52,32.85 CARD1.3 ; 22.03,30.72 R2.2
  Bottom Layer w0.26: H7.4 v1(23.62,30.52)
CARD1_5: length 27.5
  Top Layer w0.26: R1.2 20.97,35.05 CARD1.5 15.38,35.05 15.38,30.17 15.59,29.95 17.17,29.95 17.24,29.88 17.24,27.57 20.91,23.9 24.08,23.9 H7.5
CARD1_7: length 22.4
  Top Layer w0.26: CARD1.7 17.99,37.25 v1(18.73,36.51) 19.71,35.54 21.13,35.54 R4.2
  Bottom Layer w0.26: v1(18.73,36.51) 21.08,34.16 H7.3
CARD1_8: length 6.6
  Top Layer w0.26: R5.2 21.13,39.72 19.51,39.72 18.14,38.35 CARD1.8
H5_2: length 22.7
  Bottom Layer w0.26: H6.10 38.86,47.86 37.54,49.18 37.54,56.05 37.75,56.26 46.47,56.26 47.73,55
H5_3: length 26.1
  Bottom Layer w0.26: H6.9 36.29,44.71 36.29,55.48 37.64,56.83 48.44,56.83 50.27,55
H6_7: length 33.5
  Top Layer w0.26: v1(35.05,42.64) 34.85,42.44 32.92,42.44 U1.2
  Bottom Layer w0.26: v1(35.05,42.64) 35.05,49.86 35.45,50.26 35.45,55.55 34.69,56.31 30.8,56.31 30.48,55.99 30.48,45.44 H6.7
H6_8: length 9.1
  Top Layer w0.26: v1(33.36,39.41) 31.93,39.41 30.97,40.37 U1.5
  Bottom Layer w0.26: H6.8 33.36,44.25 v1(33.36,39.41)
H7_8: length 45
  Top Layer w0.26: R12.1 43.81,39.94 43.81,38.46 ; 43.81,38.46 44.26,38.46 ; 43.81,38.46 43.81,37.91 43.55,37.65 v1(40.13,37.65)
  Bottom Layer w0.26: LDR.2 42.67,53.6 42.67,40.19 v1(40.13,37.65) 40.13,28.17 H7.8
H7_11: length 22.5
  Top Layer w0.26: H7.11 37.91,25.31 C4.2 ; v1(42.38,30.78) R8.1 43.91,33.38 44.11,33.38 R7.2
  Bottom Layer w0.26: v1(42.38,30.78) 42.38,22.8 H7.11
LDAT1_2: length 53.6
  Top Layer w0.26: LDAT1.2 7.88,53.88 5.83,53.88 3.78,51.83 3.78,49 6.1,46.68 31.04,46.68 32.51,45.21 32.51,44.09 33.2,43.4 38.62,43.4 39.61,42.41 39.61,38.2 38.77,38.2
LDAT2_2: length 34.8
  Top Layer w0.26: v1(36.93,48.89) 22.51,48.89 21.74,49.66 21.74,55.4 21.02,56.12 19.12,56.12 LED2.2 ; v1(38.17,41.94) 38.36,41.75 38.77,41.75 38.77,40.87
  Bottom Layer w0.26: v1(38.17,41.94) 37.59,42.52 37.59,48.22 v1(36.93,48.89)
SW1_1: length 50.9
  Top Layer w0.26: v1(29,24.26) 29.2,24.47 29.28,24.47 29.28,25.25
  Bottom Layer w0.26: 27.7,24.26 v1(29,24.26) ; 27.7,24.26 27.7,33.74 22.35,39.09 22.35,45.32 23.09,46.06 27.32,46.06 H6.6 ; 27.7,24.26 27.43,24 27.43,9.83 25,7.4
SW1_A: length 46.6
  Top Layer w0.26: 32.47,24.41 32.09,24.41 31.71,24.79 31.71,26.32 v1(31.88,26.49) ; 32.47,24.41 32.89,24.41 33.85,25.37 ; 32.47,24.41 32.47,19.23 34.55,17.15 34.55,15.53 38.93,11.15 39.99,11.15 40.79,10.35 40.79,8.69 SW1.A
  Bottom Layer w0.26: H6.5 31.88,38.96 v1(31.88,26.49)
SW1_B: length 57.5
  Top Layer w0.26: SW1.B 35.05,16.85 35.05,27.44 34.58,27.91 33.85,27.91
  Bottom Layer w0.26: H6.4 29.97,38.33 29.97,21.3 38.87,12.4 SW1.B
U1_3: length 6.9
  Top Layer w0.26: U1.3 32.27,40.07 34.47,40.07 36.34,38.2 R11.1
U1_6: length 10.1
  Top Layer w0.26: v1(33.11,38.12) 32.28,38.12 30.32,40.07 U1.6 ; R10.1 v1(35.67,40.87)
  Bottom Layer w0.26: v1(33.11,38.12) 35.67,40.67 v1(35.67,40.87)
U2_2: length 50.7
  Top Layer w0.26: D1.1 L1.2 53.7,39.2 53.7,34.95
  Top Layer w1.2: D1.1 L1.2 53.7,39.2 U2.2

## Copper pours and planes (outline as drawn; the poured copper is in the pictures)
+5V on Top Layer: 0.1,-0.1 0.1,58 0.15,58.05 0.1,58.1 0.2,58.1 64,58 64,0 0.2,0
GND on Bottom Layer: -0.05,58.25 0.05,58.36 0.05,58.55 1.35,59.85 0.05,58.36 0.05,58.25 62,58 64,58 64,0 0.05,0.15 0.05,58.25

## Text on the board
Top Silkscreen Layer: G | DT | CL | 3V3 | LED1
